# Altium schematic sheet Module B High-Speed.SchDoc
size A3; SheetNumber: 5; SheetTotal: 7
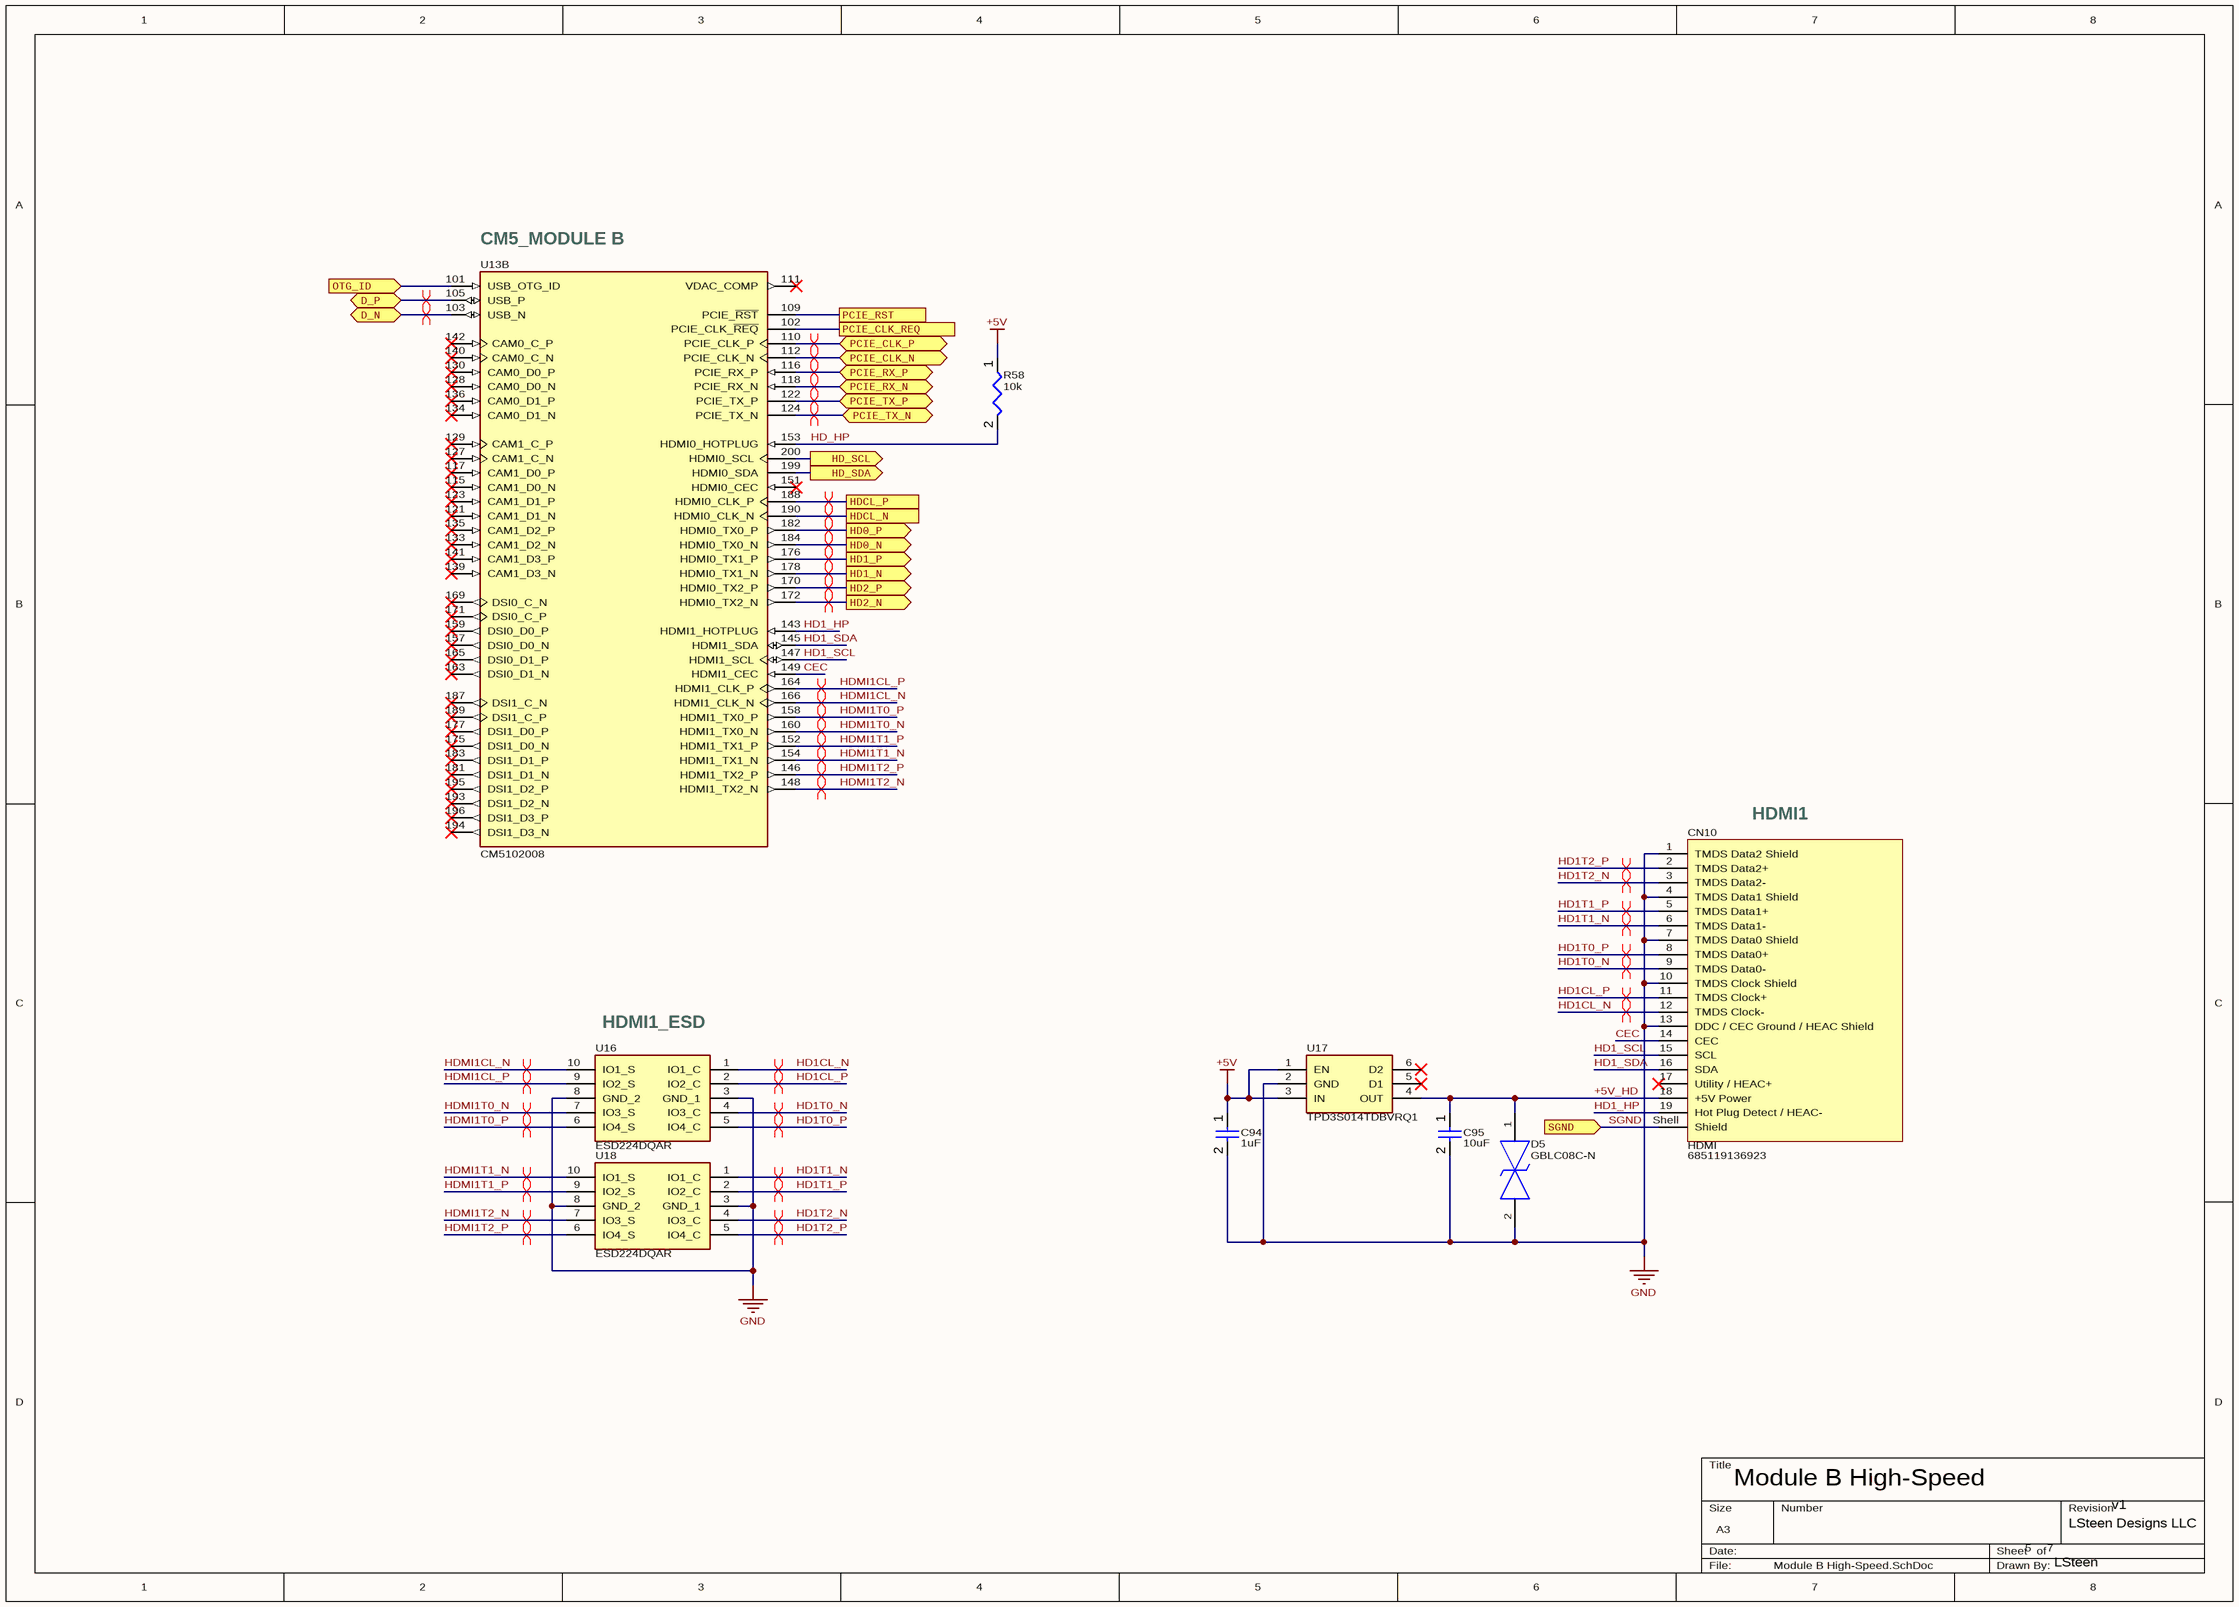
[diagram p0: Module B High-Speed.SchDoc]

## Parts
C94  1uF  [CAPC0603(1608)100_L]
C95  10uF  [CAPC0805(2012)145_L]
CN10  HDMI  [685119136923]
D5  GBLC08C-N  [SOD-323_L1.8-W1.3-LS2.5-BI]
R58  10k  [RESC0402(1005)_L]
U13  CM5102008  [MODULE_CM4102008]  (part B of 2)
U16  ESD224DQAR  [ESD224DQAR]
U17  TPD3S014TDBVRQ1  [SOT95P280X145-6N]
U18  ESD224DQAR  [ESD224DQAR]

## Ports
D_N (bidir, see USB[3C]), D_P (bidir, see USB[3C]), HD0_N (out, see Display[5A]), HD0_P (out, see Display[5A]), HD1_N (out, see Display[6A]), HD1_P (out, see Display[6A]), HD2_N (out, see Display[6A]), HD2_P (out, see Display[6A]), HD_SCL (out, see Display[3B]), HD_SDA (out, see Display[3B]), HDCL_N (see Display[5A]), HDCL_P (see Display[5A]), OTG_ID (in, see USB[2C]), PCIE_CLK_N (bidir, see USB[7B]), PCIE_CLK_P (bidir, see USB[7B]), PCIE_CLK_REQ (see USB[7B]), PCIE_RST (see USB[7B]), PCIE_RX_N (bidir, see USB[7B]), PCIE_RX_P (bidir, see USB[7B]), PCIE_TX_N (bidir, see USB[7B]), PCIE_TX_P (bidir, see USB[7B]), SGND (in, see Power[1A])

## Nets
+5V: C94.1 R58.1 U17.1(EN) U17.3(IN)
GND: C94.2 C95.2 CN10.1(TMDS_Data2_Shield) CN10.4(TMDS_Data1_Shield) CN10.7(TMDS_Data0_Shield) CN10.10(TMDS_Clock_Shield) CN10.13(DDC_/_CEC_Ground_/_HEAC_Shield) D5.2 U16.3(GND_1) U16.8(GND_2) U17.2(GND) U18.3(GND_1) U18.8(GND_2)
+5V_HD: C95.1 CN10.18(+5V_Power) D5.1 U17.4(OUT)
CEC: CN10.14(CEC) U13.149(HDMI1_CEC)
D_N: U13.103(USB_N) ; port D_N
D_P: U13.105(USB_P) ; port D_P
HD0_N: U13.184(HDMI0_TX0_N) ; port HD0_N
HD0_P: U13.182(HDMI0_TX0_P) ; port HD0_P
HD1_HP: CN10.19(Hot_Plug_Detect_/_HEAC-) U13.143(HDMI1_HOTPLUG)
HD1_N: U13.178(HDMI0_TX1_N) ; port HD1_N
HD1_P: U13.176(HDMI0_TX1_P) ; port HD1_P
HD1_SCL: CN10.15(SCL) U13.147(HDMI1_SCL)
HD1_SDA: CN10.16(SDA) U13.145(HDMI1_SDA)
HD1CL_N: CN10.12(TMDS_Clock-) U16.1(IO1_C)
HD1CL_P: CN10.11(TMDS_Clock+) U16.2(IO2_C)
HD1T0_N: CN10.9(TMDS_Data0-) U16.4(IO3_C)
HD1T0_P: CN10.8(TMDS_Data0+) U16.5(IO4_C)
HD1T1_N: CN10.6(TMDS_Data1-) U18.1(IO1_C)
HD1T1_P: CN10.5(TMDS_Data1+) U18.2(IO2_C)
HD1T2_N: CN10.3(TMDS_Data2-) U18.4(IO3_C)
HD1T2_P: CN10.2(TMDS_Data2+) U18.5(IO4_C)
HD2_N: U13.172(HDMI0_TX2_N) ; port HD2_N
HD2_P: U13.170(HDMI0_TX2_P) ; port HD2_P
HD_HP: R58.2 U13.153(HDMI0_HOTPLUG)
HD_SCL: U13.200(HDMI0_SCL) ; port HD_SCL
HD_SDA: U13.199(HDMI0_SDA) ; port HD_SDA
HDCL_N: U13.190(HDMI0_CLK_N) ; port HDCL_N
HDCL_P: U13.188(HDMI0_CLK_P) ; port HDCL_P
HDMI1CL_N: U13.166(HDMI1_CLK_N) U16.10(IO1_S)
HDMI1CL_P: U13.164(HDMI1_CLK_P) U16.9(IO2_S)
HDMI1T0_N: U13.160(HDMI1_TX0_N) U16.7(IO3_S)
HDMI1T0_P: U13.158(HDMI1_TX0_P) U16.6(IO4_S)
HDMI1T1_N: U13.154(HDMI1_TX1_N) U18.10(IO1_S)
HDMI1T1_P: U13.152(HDMI1_TX1_P) U18.9(IO2_S)
HDMI1T2_N: U13.148(HDMI1_TX2_N) U18.7(IO3_S)
HDMI1T2_P: U13.146(HDMI1_TX2_P) U18.6(IO4_S)
OTG_ID: U13.101(USB_OTG_ID) ; port OTG_ID
PCIE_CLK_N: U13.112(PCIE_CLK_N) ; port PCIE_CLK_N
PCIE_CLK_P: U13.110(PCIE_CLK_P) ; port PCIE_CLK_P
PCIE_CLK_REQ: U13.102(PCIE_CLK_~{REQ}) ; port PCIE_CLK_REQ
PCIE_RST: U13.109(PCIE_~{RST}) ; port PCIE_RST
PCIE_RX_N: U13.118(PCIE_RX_N) ; port PCIE_RX_N
PCIE_RX_P: U13.116(PCIE_RX_P) ; port PCIE_RX_P
PCIE_TX_N: U13.124(PCIE_TX_N) ; port PCIE_TX_N
PCIE_TX_P: U13.122(PCIE_TX_P) ; port PCIE_TX_P
SGND: CN10.Shell(Shield) ; port SGND

Not connected (* = marked no-connect by the designer): CN10 17(Utility_/_HEAC+)*; U13 111(VDAC_COMP)* 115(CAM1_D0_N)* 117(CAM1_D0_P)* 121(CAM1_D1_N)* 123(CAM1_D1_P)* 127(CAM1_C_N)* 128(CAM0_D0_N)* 129(CAM1_C_P)* 130(CAM0_D0_P)* 133(CAM1_D2_N)* 134(CAM0_D1_N)* 135(CAM1_D2_P)* 136(CAM0_D1_P)* 139(CAM1_D3_N)* 140(CAM0_C_N)* 141(CAM1_D3_P)* 142(CAM0_C_P)* 151(HDMI0_CEC)* 157(DSI0_D0_N)* 159(DSI0_D0_P)* 163(DSI0_D1_N)* 165(DSI0_D1_P)* 169(DSI0_C_N)* 171(DSI0_C_P)* 175(DSI1_D0_N)* 177(DSI1_D0_P)* 181(DSI1_D1_N)* 183(DSI1_D1_P)* 187(DSI1_C_N)* 189(DSI1_C_P)* 193(DSI1_D2_N)* 194(DSI1_D3_N)* 195(DSI1_D2_P)* 196(DSI1_D3_P)*; U17 5(D1)* 6(D2)*

## Layout directives
differential pair; differential pair class HDMI: HD0_N, HD0_P, HD1_N, HD1_P, HD1CL_N, HD1CL_P, HD1T0_N, HD1T0_P, HD1T1_N, HD1T1_P, HD1T2_N, HD1T2_P, HD2_N, HD2_P, HDCL_N, HDCL_P, HDMI1CL_N, HDMI1CL_P, HDMI1T0_N, HDMI1T0_P, HDMI1T1_N, HDMI1T1_P, HDMI1T2_N, HDMI1T2_P
differential pair; differential pair class USB 2.0: D_N, D_P
differential pair; differential pair class PCIe Gen 3x1: PCIE_CLK_N, PCIE_CLK_P, PCIE_RX_N, PCIE_RX_P, PCIE_TX_N, PCIE_TX_P

## Notes on the sheet
- (near U13) CM5_MODULE B
- HDMI1
- (near U16) HDMI1_ESD
- (near CN10) 685119136923
- Module B High-Speed
- 5
- 7
- LSteen Designs LLC
- v1
- LSteen

## Library data of the parts
C94 = CMP-001-00076-4: Chip Capacitor, 1uF +/-20%, 10V, 0603, Thickness 1 mm; Tolerance: 10%; Mounting Technology: SMT; Case/Package: 0603; Pins: 2; Min Operating Temperature: -55°C; Max Operating Temperature: 85°C; Value: 1uF; Voltage Rating: 10V
C95 = CMP-001-00079-4: Chip Capacitor, 10µF +/-20%, 25V, 0805, Thickness 1.45 mm; Tolerance: 10%; Max Operating Temperature: 85°C; Value: 10µF; Case/Package: 0805; Voltage Rating: 25V; Min Operating Temperature: -55°C; Mounting Technology: SMT; Pins: 2
CN10 = CMP-1502-00171-2: NexarPartId: 19499823; Number of Contacts: 19; Gender: Receptacle; Operating Supply Voltage: 40V; Contact Resistance: 30mΩ; Body Material: Brass; Current Rating: 500mA; Insulation Resistance: 100MΩ; Lead Free: Lead Free; Max Operating Temperature: 85°C; Packaging: Tape and Reel; Min Operating Temperature: -25°C; Features: Shielded; Orientation: Horizontal; Height: 3.45mm; Number of Positions: 19; Voltage Rating: 40V; Number of Pins: 19; Connector Type: HDMI; Mount: Horizontal, Surface Mount; Contact Material: Gold; Termination: SMD/SMT; Contact Plating: Gold; RoHS: Compliant; REACH SVHC: Unknown
D5 = GBLC08C-N: ESD DIODE-BI_LCSC#C314256
R58 = CMP-009-00138-3: Chip Resistor, 10 kOhms, +/-5 %, 63 mW, -55 to 155 degC, 0402; Tolerance: 5%; Power: 63mW; Max Operating Temperature: 155°C; Pins: 2; Value: 10k; Min Operating Temperature: -55°C; Case/Package: 0402
U13 = CM4102008: Raspberry Pi Compute Module 4 with WiFi 2GB RAM 8GB Flash | Raspberry Pi CM4102008; SnapEDA_Link: https://www.snapeda.com/parts/CM4102008/Raspberry+Pi/view-part/?ref=snap; Package: None; Value: *; MF: Raspberry Pi; MP: CM4102008; Check_prices: https://www.snapeda.com/parts/CM4102008/Raspberry+Pi/view-part/?ref=eda
U16 U18 = ESD224DQAR: Integrated Circuit; Manufacturer_Name: Texas Instruments; Datasheet Link: http://www.ti.com/lit/gpn/esd224; Height: 0.55mm; Manufacturer_Part_Number: ESD224DQAR; Mouser Part Number: 595-ESD224DQAR; Mouser Price/Stock: https://www.mouser.co.uk/ProductDetail/Texas-Instruments/ESD224DQAR?qs=F5EMLAvA7IDFPTOz5JtaBw%3D%3D; Arrow Part Number: ESD224DQAR; Arrow Price/Stock: https://www.arrow.com/en/products/esd224dqar/texas-instruments?region=nac
U17 = TPD3S014TDBVRQ1: Switch; Manufacturer_Name: Texas Instruments; Datasheet Link: http://www.ti.com/lit/gpn/tpd3s014-q1; Height: 1.45mm; Manufacturer_Part_Number: TPD3S014TDBVRQ1; Mouser Part Number: 595-TPD3S014TDBVRQ1; Mouser Price/Stock: https://www.mouser.co.uk/ProductDetail/Texas-Instruments/TPD3S014TDBVRQ1?qs=f4l5qYp%2Fy%252B4t4RRhQp5Ndw%3D%3D; Arrow Part Number: TPD3S014TDBVRQ1; Arrow Price/Stock: https://www.arrow.com/en/products/tpd3s014tdbvrq1/texas-instruments?region=nac